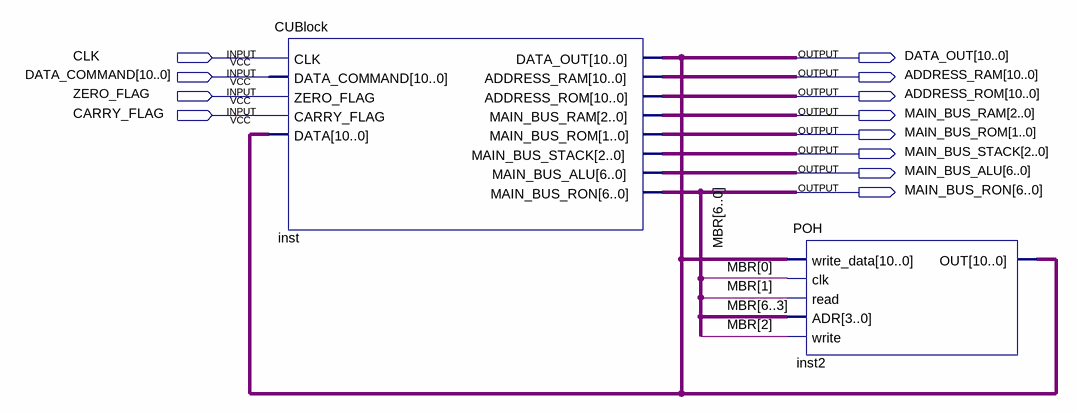
[diagram p0: schematic sheet]
// Quartus schematic CPUBlock.bdf as structural Verilog: 2 symbols, 12 pins
module CPUBlock (
  input  CLK,
  input  [10:0] DATA_COMMAND,
  input  ZERO_FLAG,
  input  CARRY_FLAG,
  output [10:0] DATA_OUT,
  output [10:0] ADDRESS_RAM,
  output [10:0] ADDRESS_ROM,
  output [2:0] MAIN_BUS_RAM,
  output [1:0] MAIN_BUS_ROM,
  output [2:0] MAIN_BUS_STACK,
  output [6:0] MAIN_BUS_ALU,
  output [6:0] MAIN_BUS_RON
);

  CUBlock inst (
    .CLK(CLK), .DATA_COMMAND(DATA_COMMAND), .ZERO_FLAG(ZERO_FLAG), .CARRY_FLAG(CARRY_FLAG), .DATA(DATA_OUT),
    .DATA_OUT(DATA_OUT), .ADDRESS_RAM(ADDRESS_RAM), .ADDRESS_ROM(ADDRESS_ROM), .MAIN_BUS_RAM(MAIN_BUS_RAM),
    .MAIN_BUS_ROM(MAIN_BUS_ROM), .MAIN_BUS_STACK(MAIN_BUS_STACK), .MAIN_BUS_ALU(MAIN_BUS_ALU),
    .MAIN_BUS_RON(MAIN_BUS_RON));
  POH inst2 (
    .write_data(DATA_OUT), .clk(MAIN_BUS_RON[0]), .read(MAIN_BUS_RON[1]), .ADR(MAIN_BUS_RON[6:3]),
    .write(MAIN_BUS_RON[2]), .OUT(DATA_OUT));

  // Other names for the same wires on the sheet: MBR[6:0] = MAIN_BUS_RON
endmodule
